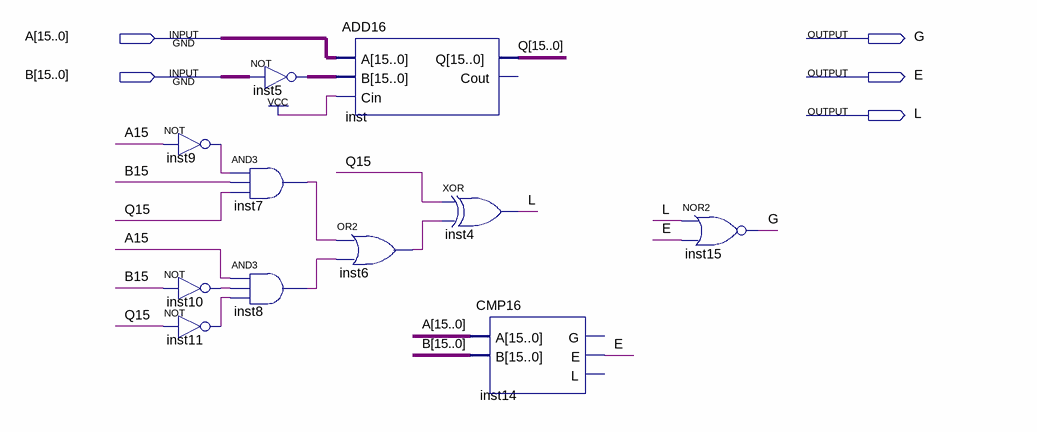
[diagram p0: schematic sheet]
// Quartus schematic SCMP16.bdf as structural Verilog: 11 symbols, 5 pins
module SCMP16 (
  input  [15:0] A,
  input  [15:0] B,
  output G,
  output E,
  output L
);

  wire inst6_out, inst7_out, inst8_out, inst9_out, inst10_out, inst11_out;
  wire [15:0] inst5_out, Q;

  not inst9 (inst9_out, A[15]);
  not inst10 (inst10_out, B[15]);
  not inst11 (inst11_out, Q[15]);
  and inst7 (inst7_out, inst9_out, B[15], Q[15]);
  and inst8 (inst8_out, A[15], inst10_out, inst11_out);
  assign inst5_out = ~B;  // NOT inst5, 16 bits wide
  ADD16 inst (.A(A), .B(inst5_out), .Cin(1'b1), .Q(Q));  // open: Cout
  or inst6 (inst6_out, inst7_out, inst8_out);
  xor inst4 (L, Q[15], inst6_out);
  CMP16 inst14 (.A(A), .B(B), .E(E));  // open: G, L
  nor inst15 (G, L, E);
endmodule
